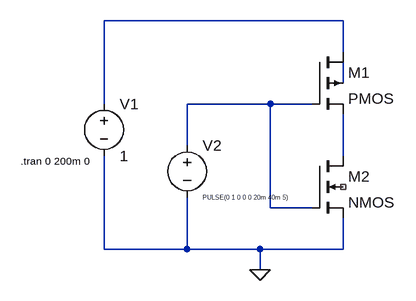
[diagram p0: schematic CMOS Inverter.asc]
CMOS Inverter.asc, the LTspice schematic file:
Version 4
SHEET 1 880 680
WIRE 256 16 -112 16
WIRE 256 64 256 16
WIRE 256 112 256 80
WIRE -112 144 -112 16
WIRE 144 144 16 144
WIRE 208 144 144 144
WIRE 16 208 16 144
WIRE 256 224 256 160
WIRE 144 304 144 144
WIRE 208 304 144 304
WIRE -112 368 -112 224
WIRE 16 368 16 288
WIRE 16 368 -112 368
WIRE 128 368 16 368
WIRE 256 368 256 320
WIRE 256 368 128 368
WIRE 128 400 128 368
FLAG 128 400 0
SYMBOL pmos4 208 64 R0
SYMATTR InstName M1
SYMBOL nmos4 208 224 R0
SYMATTR InstName M2
SYMBOL voltage -112 128 R0
WINDOW 123 0 0 Left 0
WINDOW 39 0 0 Left 0
SYMATTR InstName V1
SYMATTR Value 1
SYMBOL voltage 16 192 R0
WINDOW 3 24 96 Left 0
WINDOW 123 0 0 Left 0
WINDOW 39 0 0 Left 0
SYMATTR InstName V2
SYMATTR Value PULSE(0 1 0 0 0 20m 40m 5)
TEXT -240 232 Left 1 !.tran 0 200m 0

The netlist it stands for:
* CMOS Inverter.asc
M1 N001 N003 N004 N002 PMOS
M2 N004 N003 0 NC_01 NMOS
V1 N001 0 1
V2 N003 0 PULSE(0 1 0 0 0 20m 40m 5)
.model NMOS NMOS
.model PMOS PMOS
.lib standard.mos
.tran 0 200m 0
.backanno
.end